# EAGLE schematic Proj_v27 (EAGLE 9.6.0)

## Sheet 1 of 7
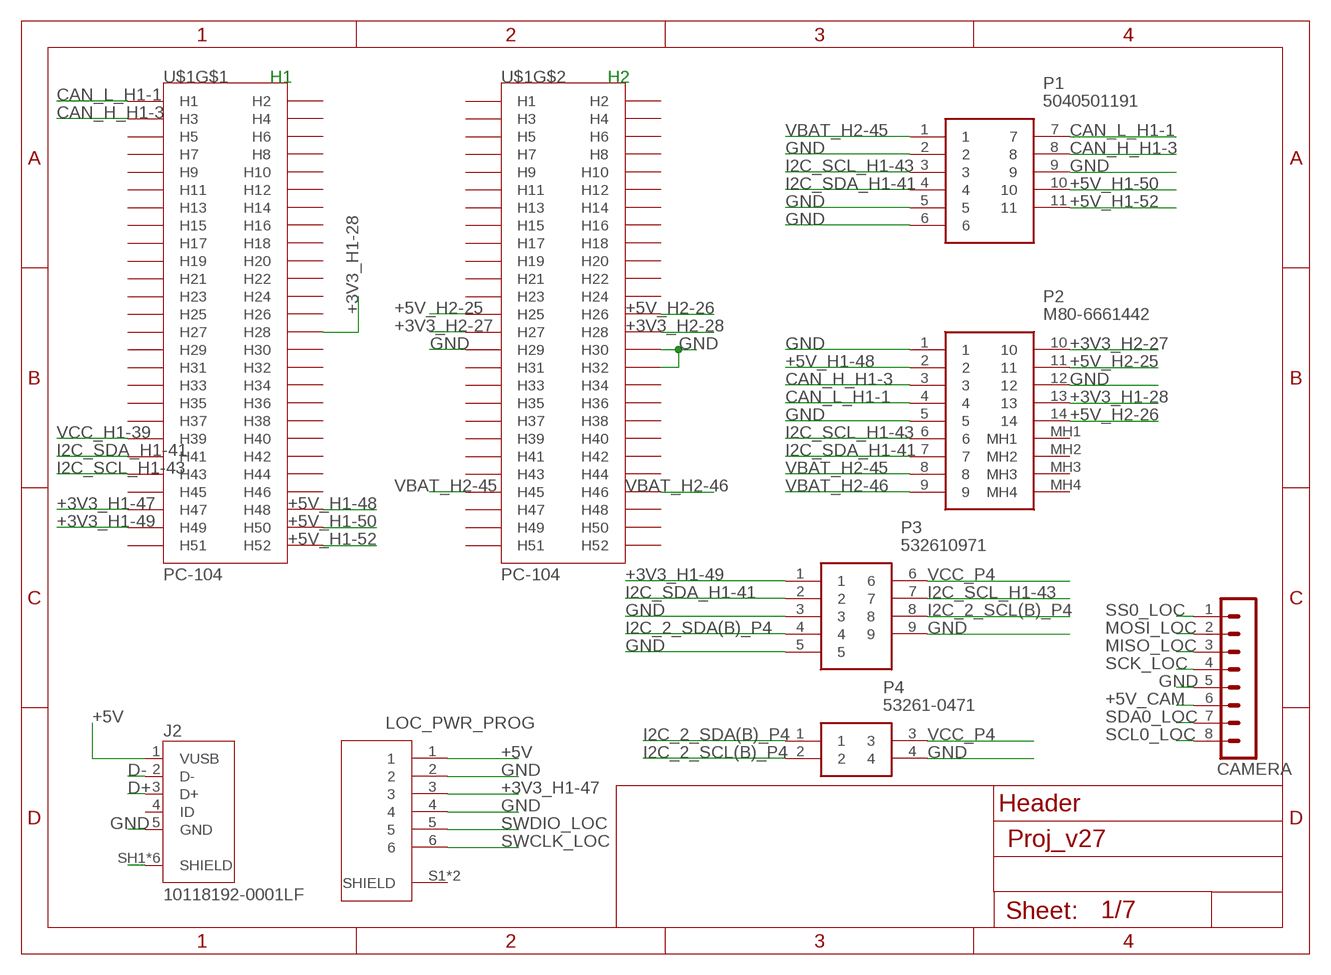
[diagram p0: schematic, sheet 1]

### Parts
CAMERA  MA08-1  [MA08-1]
J2  10118192-0001LF  [AMPHENOL_10118192-0001LF]
LOC_PWR_PROG  0532610671  [MOLEX_0532610671]
P1  5040501191  [5040501191]
P2  M80-6661442  [M806661442]
P3  532610971  [532610971]
P4  53261-0471  [53261-0471]
U$1  PC-104  [PC-104]

### Nets
+3V3_H1-28: P2.13 U$1.P$28(H28)
+3V3_H1-47: LOC_PWR_PROG.3 U$1.P$47(H47) ; also sheet 2,3,4,5
+3V3_H1-49: P3.1 U$1.P$49(H49)
+3V3_H2-27: P2.10 U$1.P$79(H27)
+3V3_H2-28: U$1.P$80(H28)
+5V: J2.1(VUSB) LOC_PWR_PROG.1 ; also sheet 2,5
+5V_CAM: CAMERA.6 ; also sheet 2
+5V_H1-48: P2.2 U$1.P$48(H48)
+5V_H1-50: P1.10 U$1.P$50(H50)
+5V_H1-52: P1.11 U$1.P$52(H52)
+5V_H2-25: P2.11 U$1.P$77(H25)
+5V_H2-26: P2.14 U$1.P$78(H26)
CAN_H_H1-3: P1.8 P2.3 U$1.P$3(H3)
CAN_L_H1-1: P1.7 P2.4 U$1.P$1(H1)
D+: J2.3(D+) ; also sheet 3
D-: J2.2(D-) ; also sheet 3
GND [GND]: CAMERA.5 J2.5(GND) J2.SH1(SHIELD) J2.SH2(SHIELD) J2.SH3(SHIELD) J2.SH4(SHIELD) J2.SH5(SHIELD) J2.SH6(SHIELD) LOC_PWR_PROG.2 LOC_PWR_PROG.4 P1.2 P1.5 P1.6 P1.9 P2.1 P2.5 P2.12 P3.3 P3.5 P3.9 P4.4 U$1.P$81(H29) U$1.P$82(H30) U$1.P$84(H32) ; also sheet 2,3,4,5,6,7
I2C_2_SCL(B)_P4: P3.8 P4.2
I2C_2_SDA(B)_P4: P3.4 P4.1
I2C_SCL_H1-43: P1.3 P2.6 P3.7 U$1.P$43(H43) ; also sheet 3
I2C_SDA_H1-41: P1.4 P2.7 P3.2 U$1.P$41(H41) ; also sheet 3
MISO_LOC: CAMERA.3 ; also sheet 3
MOSI_LOC: CAMERA.2 ; also sheet 3
SCK_LOC: CAMERA.4 ; also sheet 3
SCL0_LOC: CAMERA.8 ; also sheet 3
SDA0_LOC: CAMERA.7 ; also sheet 3
SS0_LOC: CAMERA.1 ; also sheet 3
SWCLK_LOC: LOC_PWR_PROG.6 ; also sheet 3
SWDIO_LOC: LOC_PWR_PROG.5 ; also sheet 3
VBAT_H2-45: P1.1 P2.8 U$1.P$97(H45)
VBAT_H2-46: P2.9 U$1.P$98(H46)
VCC_H1-39: U$1.P$39(H39)
VCC_P4: P3.6 P4.3
Unconnected: J2.4(ID) LOC_PWR_PROG.S1(SHIELD) LOC_PWR_PROG.S2(SHIELD) P2.MH1 P2.MH2 P2.MH3 P2.MH4 U$1.P$2(H2) U$1.P$4(H4) U$1.P$5(H5) U$1.P$6(H6) U$1.P$7(H7) U$1.P$8(H8) U$1.P$9(H9) U$1.P$10(H10) U$1.P$11(H11) U$1.P$12(H12) U$1.P$13(H13) U$1.P$14(H14) U$1.P$15(H15) U$1.P$16(H16) U$1.P$17(H17) U$1.P$18(H18) U$1.P$19(H19) U$1.P$20(H20) U$1.P$21(H21) U$1.P$22(H22) U$1.P$23(H23) U$1.P$24(H24) U$1.P$25(H25) U$1.P$26(H26) U$1.P$27(H27) U$1.P$29(H29) U$1.P$30(H30) U$1.P$31(H31) U$1.P$32(H32) U$1.P$33(H33) U$1.P$34(H34) U$1.P$35(H35) U$1.P$36(H36) U$1.P$37(H37) U$1.P$38(H38) U$1.P$40(H40) U$1.P$42(H42) U$1.P$44(H44) U$1.P$45(H45) U$1.P$46(H46) U$1.P$51(H51) U$1.P$53(H1) U$1.P$54(H2) U$1.P$55(H3) U$1.P$56(H4) U$1.P$57(H5) U$1.P$58(H6) U$1.P$59(H7) U$1.P$60(H8) U$1.P$61(H9) U$1.P$62(H10) U$1.P$63(H11) U$1.P$64(H12) U$1.P$65(H13) U$1.P$66(H14) U$1.P$67(H15) U$1.P$68(H16) U$1.P$69(H17) U$1.P$70(H18) U$1.P$71(H19) U$1.P$72(H20) U$1.P$73(H21) U$1.P$74(H22) U$1.P$75(H23) U$1.P$76(H24) U$1.P$83(H31) U$1.P$85(H33) U$1.P$86(H34) U$1.P$87(H35) U$1.P$88(H36) U$1.P$89(H37) U$1.P$90(H38) U$1.P$91(H39) U$1.P$92(H40) U$1.P$93(H41) U$1.P$94(H42) U$1.P$95(H43) U$1.P$96(H44) U$1.P$99(H47) U$1.P$100(H48) U$1.P$101(H49) U$1.P$102(H50) U$1.P$103(H51) U$1.P$104(H52)

### Notes on the sheet
- H1 | H2
- Header

## Sheet 2 of 7
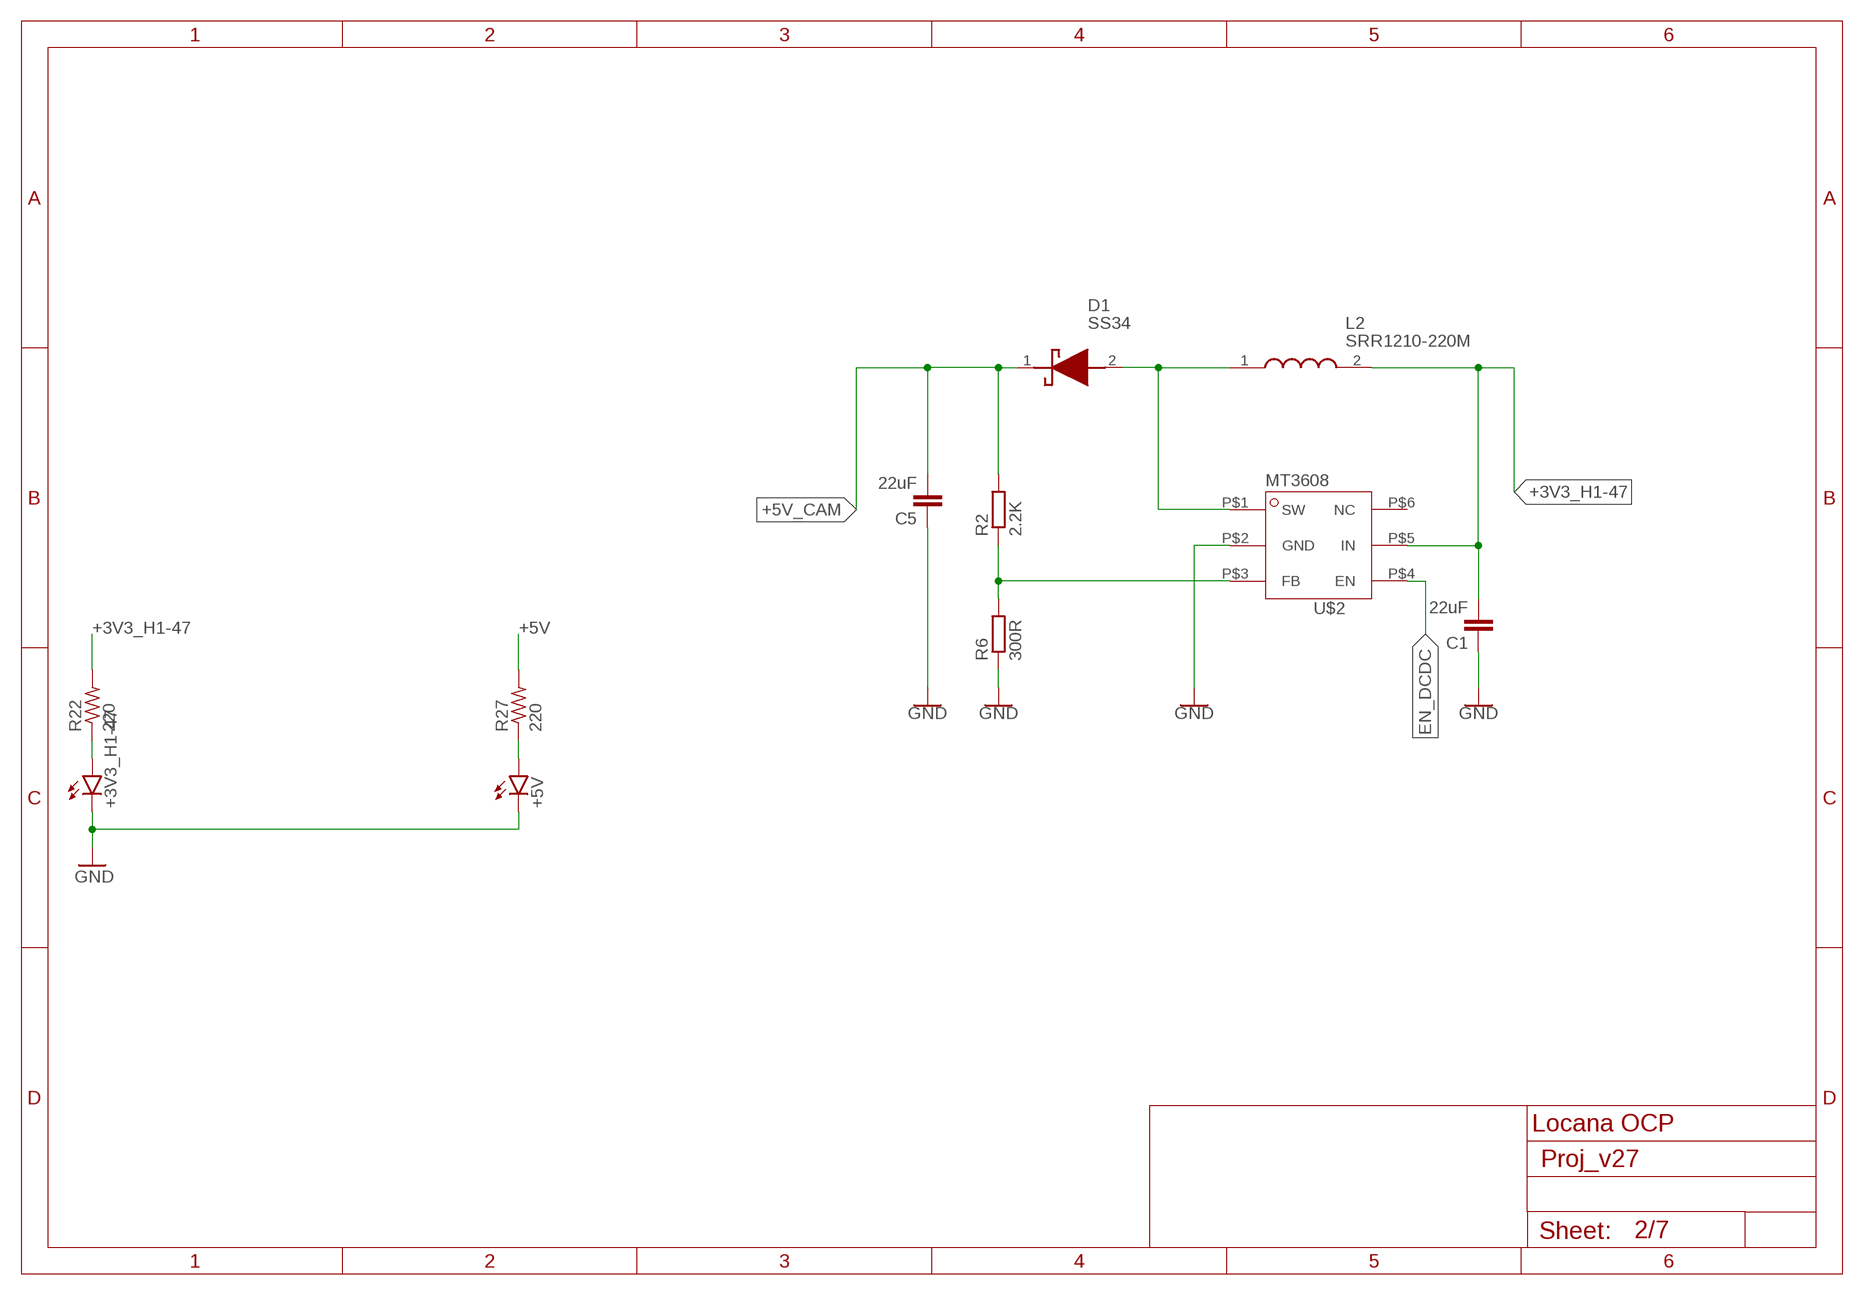
[diagram p1: schematic, sheet 2]

### Parts
+3V3_H1-47  LEDCHIP-LED0805  [CHIP-LED0805]
+5V  LEDCHIP-LED0805  [CHIP-LED0805]
C1  22uF  C-EUC0805  [C0805]
C5  22uF  C-EUC0805  [C0805]
D1  SS34  [DIOM7959X262N]
L2  SRR1210-220M  [INDPM120120X1000N]
R2  2.2K  R-EU_M0805  [M0805]
R6  300R  R-EU_M0805  [M0805]
R22  220  R-US_M0805  [M0805]
R27  220  R-US_M0805  [M0805]
U$2  MT3608SOT23-6  [SOT23-6]

### Nets
+3V3_H1-47: C1.2 L2.2 R22.2 U$2.P$5(IN) ; also sheet 1,3,4,5
+5V: R27.2 ; also sheet 1,5
+5V_CAM: C5.2 D1.1(K) R2.2 ; also sheet 1
EN_DCDC: U$2.P$4(EN) ; also sheet 3
GND [GND]: +3V3_H1-47.C +5V.C C1.1 C5.1 R6.1 U$2.P$2(GND) ; also sheet 1,3,4,5,6,7
N$7: D1.2(A) L2.1 U$2.P$1(SW)
N$13: R2.1 R6.2 U$2.P$3(FB)
N$14: +3V3_H1-47.A R22.1
N$23: +5V.A R27.1
Unconnected: U$2.P$6(NC)

### Notes on the sheet
- Locana OCP

## Sheet 3 of 7
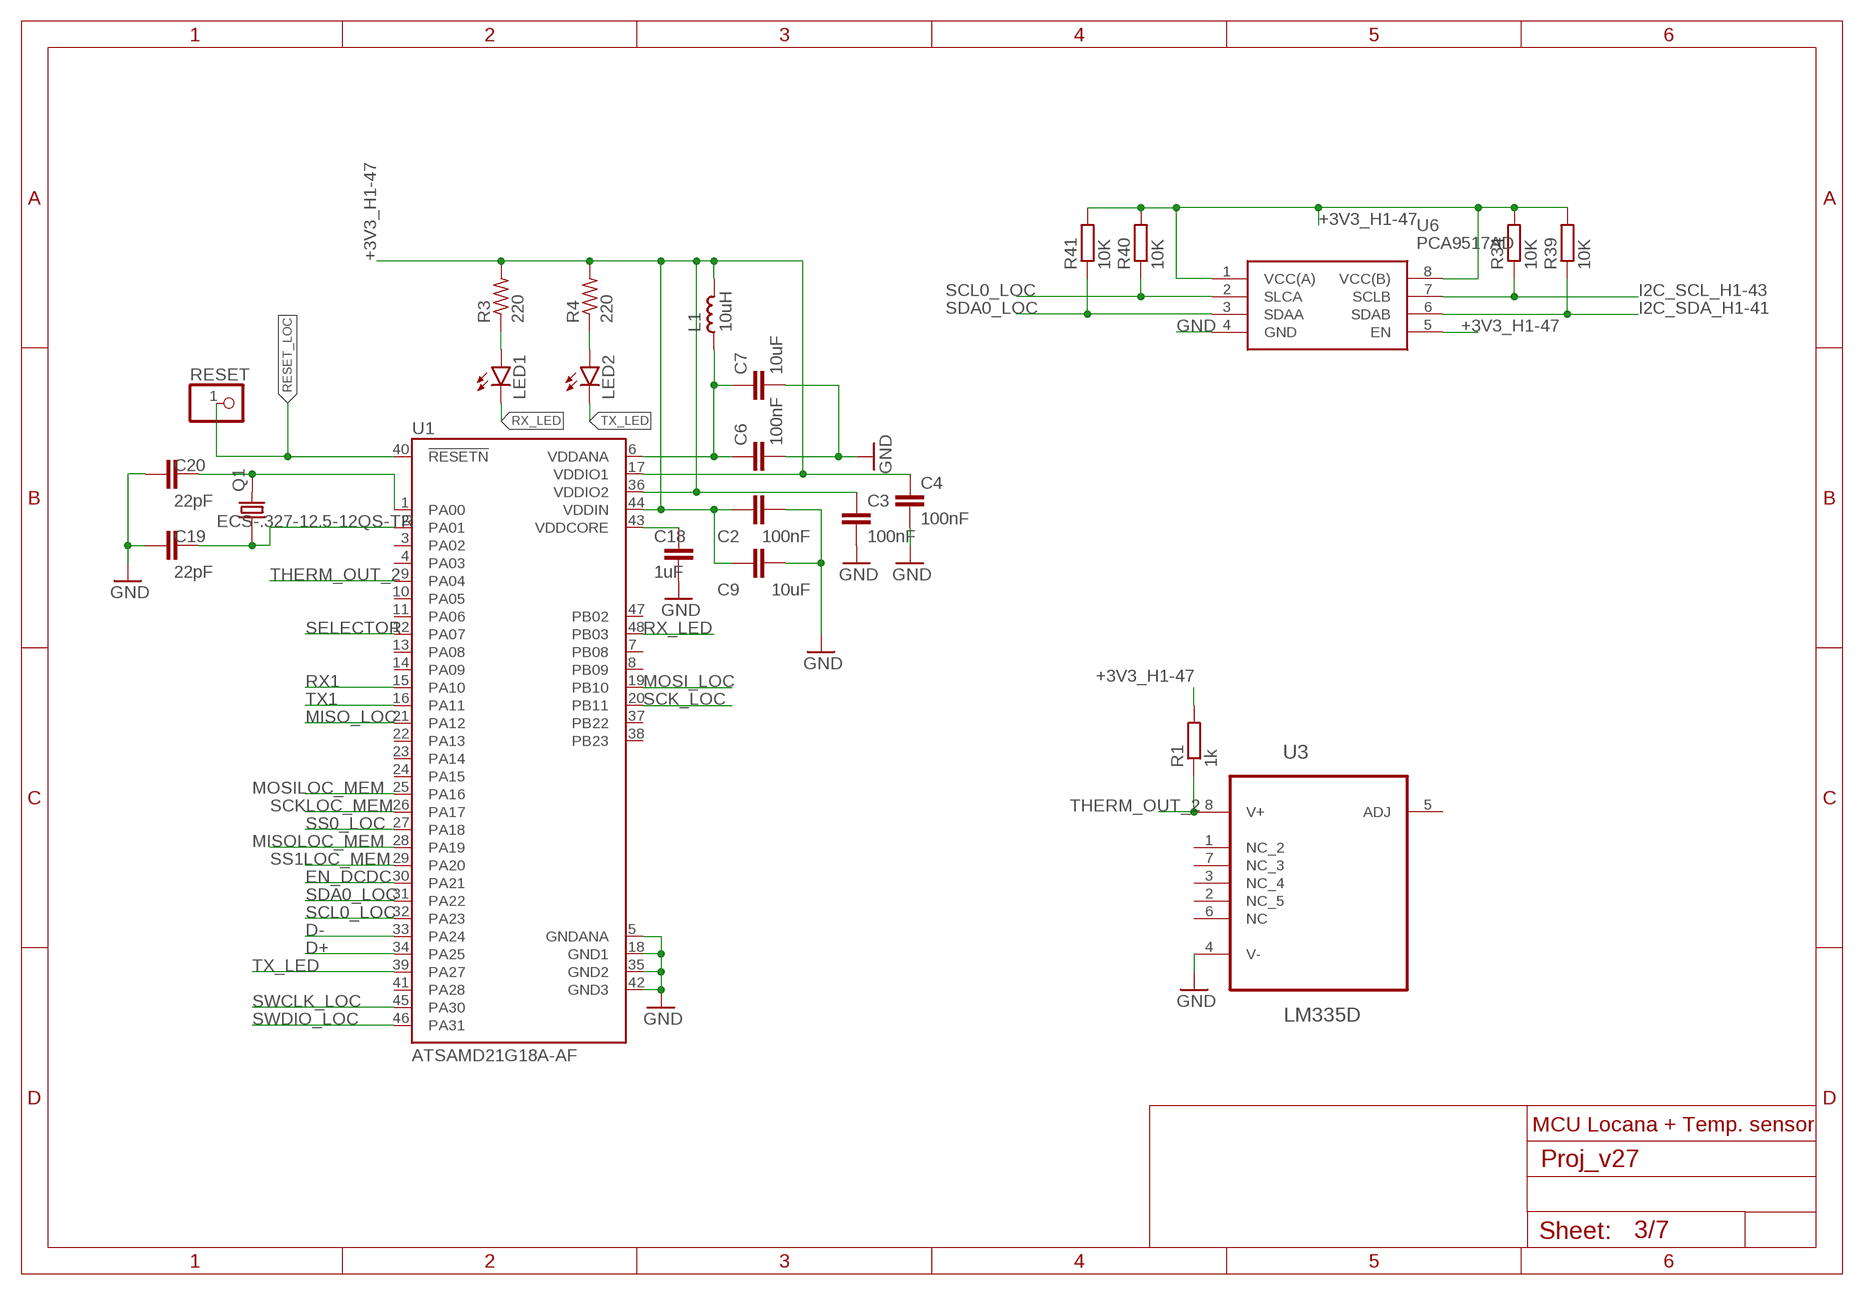
[diagram p2: schematic, sheet 3]

### Parts
C2  100nF  C-EUC0805K  [C0805K]
C3  100nF  C-EUC0805K  [C0805K]
C4  100nF  C-EUC0805K  [C0805K]
C6  100nF  C-EUC0805K  [C0805K]
C7  10uF  C-EUC0805K  [C0805K]
C9  10uF  C-EUC0805K  [C0805K]
C18  1uF  C-EUC0805K  [C0805K]
C19  22pF  C-EUC0805K  [C0805K]
C20  22pF  C-EUC0805K  [C0805K]
L1  10uH  L_0805  [L0805]
LED1  LEDCHIP-LED0805  [CHIP-LED0805]
LED2  LEDCHIP-LED0805  [CHIP-LED0805]
Q1  ECS-.327-12.5-12QS-TR  [XTAL_ECS-.327-12.5-12QS-TR]
R1  1k  R-EU_M0805  [M0805]
R3  220  R-US_M0805  [M0805]
R4  220  R-US_M0805  [M0805]
R34  10K  R-EU_M0805  [M0805]
R39  10K  R-EU_M0805  [M0805]
R40  10K  R-EU_M0805  [M0805]
R41  10K  R-EU_M0805  [M0805]
RESET  PINHD-1X1  [1X01]
U1  ATSAMD21G18A-AF  [QFP50P900X900X120-48N]
U3  LM335D  [SOIC127P600X175-8N]
U6  PCA9517AD  [SOIC127P600X175-8N]

### Nets
+3V3_H1-47: C2.1 C3.1 C4.1 C9.1 L1.1 R1.2 R3.2 R4.2 R34.2 R39.2 R40.2 R41.2 U1.17(VDDIO1) U1.36(VDDIO2) U1.44(VDDIN) U6.1(VCC(A)) U6.5(EN) U6.8(VCC(B)) ; also sheet 1,2,4,5
D+: U1.34(PA25) ; also sheet 1
D-: U1.33(PA24) ; also sheet 1
EN_DCDC: U1.30(PA21) ; also sheet 2
GND [GND]: C2.2 C3.2 C4.2 C6.2 C7.2 C9.2 C18.2 C19.1 C20.1 U1.5(GNDANA) U1.18(GND1) U1.35(GND2) U1.42(GND3) U3.4(V-) U6.4(GND) ; also sheet 1,2,4,5,6,7
I2C_SCL_H1-43: R34.1 U6.7(SCLB) ; also sheet 1
I2C_SDA_H1-41: R39.1 U6.6(SDAB) ; also sheet 1
MISO_LOC: U1.21(PA12) ; also sheet 1
MISOLOC_MEM: U1.28(PA19) ; also sheet 4
MOSI_LOC: U1.19(PB10) ; also sheet 1
MOSILOC_MEM: U1.25(PA16) ; also sheet 4
N$1: C20.2 Q1.2 U1.1(PA00)
N$6: C6.1 C7.1 L1.2 U1.6(VDDANA)
N$9: LED1.A R3.1
N$10: C18.1 U1.43(VDDCORE)
N$11: C19.2 Q1.1 U1.2(PA01)
N$12: LED2.A R4.1
RESET_LOC: RESET.1 U1.40(!RESETN)
RX1: U1.15(PA10) ; also sheet 5,7
RX_LED: LED1.C U1.48(PB03)
SCK_LOC: U1.20(PB11) ; also sheet 1
SCKLOC_MEM: U1.26(PA17) ; also sheet 4
SCL0_LOC: R40.1 U1.32(PA23) U6.2(SLCA) ; also sheet 1
SDA0_LOC: R41.1 U1.31(PA22) U6.3(SDAA) ; also sheet 1
SELECTOR: U1.12(PA07) ; also sheet 4
SS0_LOC: U1.27(PA18) ; also sheet 1
SS1LOC_MEM: U1.29(PA20) ; also sheet 4
SWCLK_LOC: U1.45(PA30) ; also sheet 1
SWDIO_LOC: U1.46(PA31) ; also sheet 1
THERM_OUT_2: R1.1 U1.9(PA04) U3.8(V+)
TX1: U1.16(PA11) ; also sheet 5,7
TX_LED: LED2.C U1.39(PA27)
Unconnected: U1.3(PA02) U1.4(PA03) U1.7(PB08) U1.8(PB09) U1.10(PA05) U1.11(PA06) U1.13(PA08) U1.14(PA09) U1.22(PA13) U1.23(PA14) U1.24(PA15) U1.37(PB22) U1.38(PB23) U1.41(PA28) U1.47(PB02) U3.1(NC_2) U3.2(NC_5) U3.3(NC_4) U3.5(ADJ) U3.6(NC) U3.7(NC_3)

### Notes on the sheet
- MCU Locana + Temp. sensor

## Sheet 4 of 7
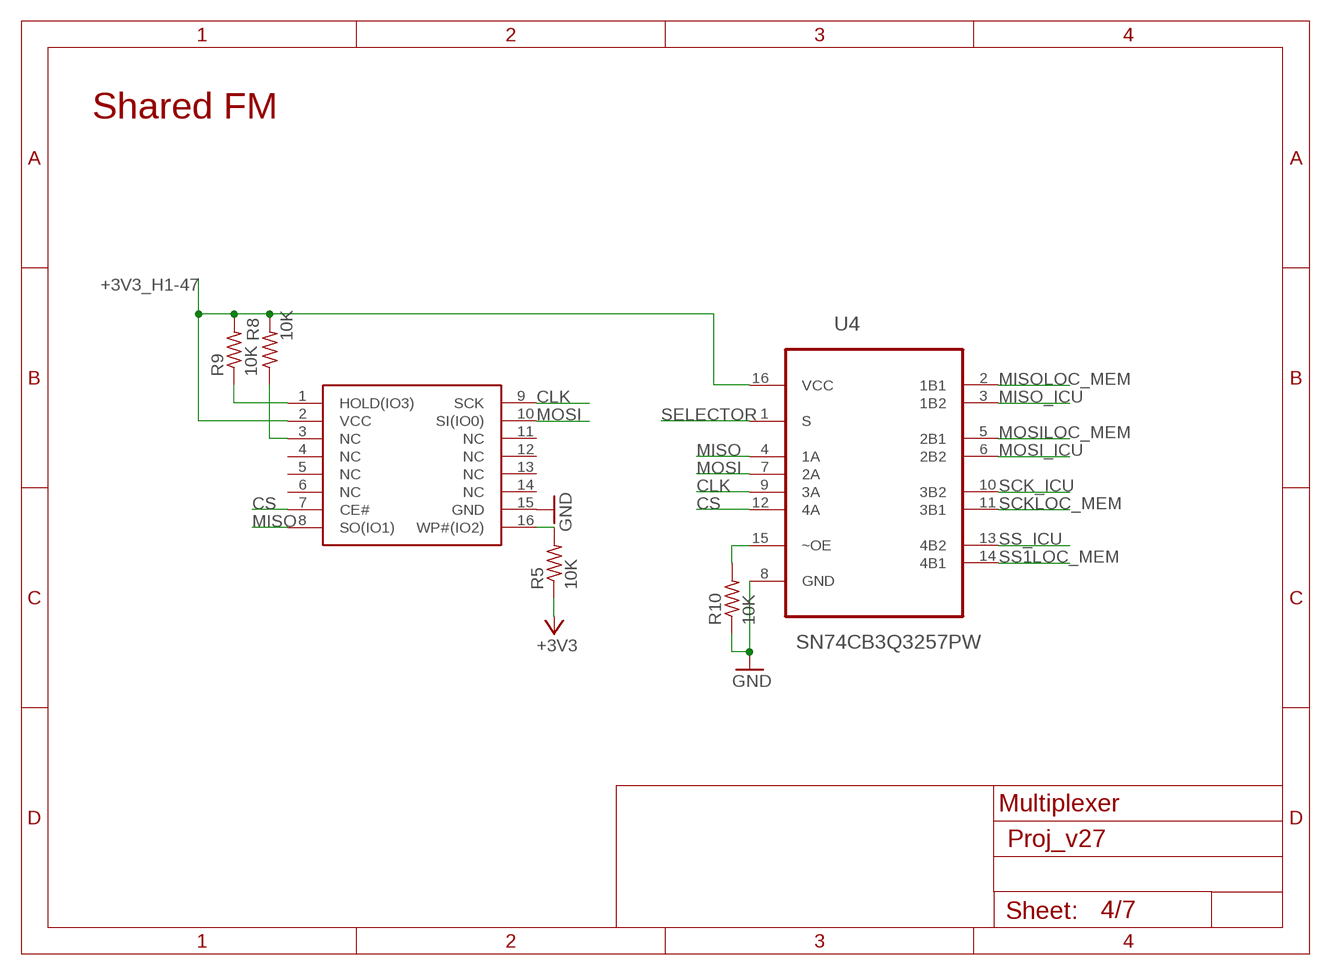
[diagram p3: schematic, sheet 4]

### Parts
LOC_MEM  SOIC127P600X175-16NSOIC-16YAS  [SOIC127P1032X265-17T480X861N]
R5  10K  R-US_M0805  [M0805]
R8  10K  R-US_M0805  [M0805]
R9  10K  R-US_M0805  [M0805]
R10  10K  R-US_M0805  [M0805]
U4  SN74CB3Q3257PW  [SOP65P640X120-16N]

### Nets
+3V3_H1-47: LOC_MEM.2(VCC) R5.1 R8.2 R9.2 U4.16(VCC) ; supply symbol labelled +3V3 ; also sheet 1,2,3,5
CLK: LOC_MEM.9(SCK) U4.9(3A)
CS: LOC_MEM.7(CE#) U4.12(4A)
GND [GND]: LOC_MEM.15(GND) R10.1 U4.8(GND) ; also sheet 1,2,3,5,6,7
MISO: LOC_MEM.8(SO(IO1)) U4.4(1A)
MISO_ICU: U4.3(1B2) ; also sheet 7
MISOLOC_MEM: U4.2(1B1) ; also sheet 3
MOSI: LOC_MEM.10(SI(IO0)) U4.7(2A)
MOSI_ICU: U4.6(2B2) ; also sheet 7
MOSILOC_MEM: U4.5(2B1) ; also sheet 3
N$2: LOC_MEM.16(WP#(IO2)) R5.2
N$3: LOC_MEM.1(HOLD(IO3)) R9.1
N$4: LOC_MEM.3(NC) R8.1
N$31: R10.2 U4.15(~OE)
SCK_ICU: U4.10(3B2) ; also sheet 7
SCKLOC_MEM: U4.11(3B1) ; also sheet 3
SELECTOR: U4.1(S) ; also sheet 3
SS1LOC_MEM: U4.14(4B1) ; also sheet 3
SS_ICU: U4.13(4B2) ; also sheet 6,7
Unconnected: LOC_MEM.4(NC) LOC_MEM.5(NC) LOC_MEM.6(NC) LOC_MEM.11(NC) LOC_MEM.12(NC) LOC_MEM.13(NC) LOC_MEM.14(NC)

### Notes on the sheet
- Shared FM
- Multiplexer

## Sheet 5 of 7
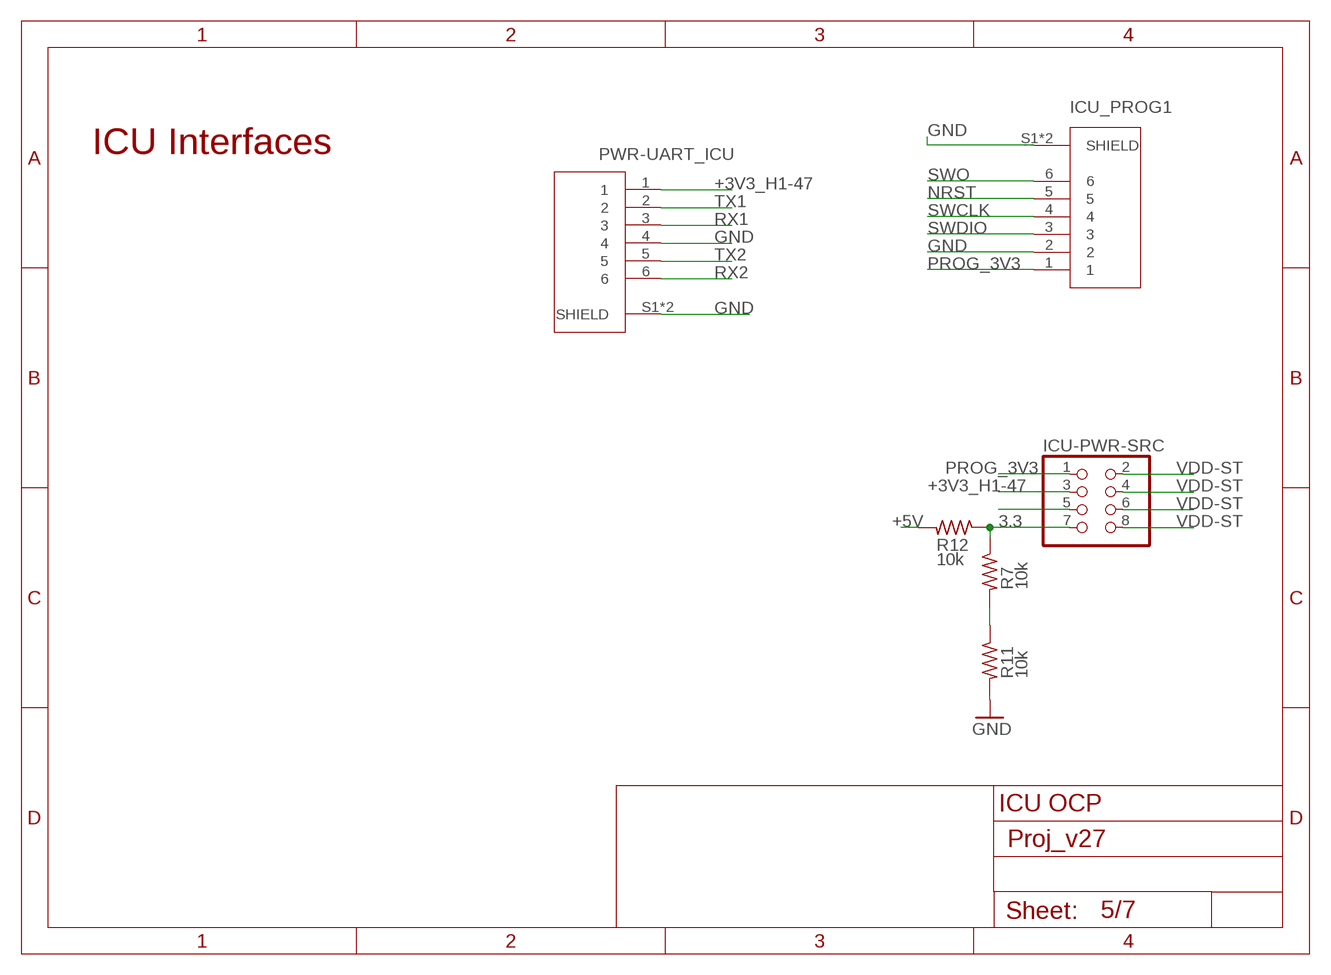
[diagram p4: schematic, sheet 5]

### Parts
ICU-PWR-SRC  PINHD-2X4  [2X04]
ICU_PROG1  0532610671  [MOLEX_0532610671]
PWR-UART_ICU  0532610671  [MOLEX_0532610671]
R7  10k  R-US_R0805  [R0805]
R11  10k  R-US_R0805  [R0805]
R12  10k  R-US_R0805  [R0805]

### Nets
3.3: ICU-PWR-SRC.7 R7.1 R12.1
+3V3_H1-47: ICU-PWR-SRC.3 PWR-UART_ICU.1 ; also sheet 1,2,3,4
+5V: R12.2 ; also sheet 1,2
GND [GND]: ICU_PROG1.2 ICU_PROG1.S1(SHIELD) ICU_PROG1.S2(SHIELD) PWR-UART_ICU.4 PWR-UART_ICU.S1(SHIELD) PWR-UART_ICU.S2(SHIELD) R11.2 ; also sheet 1,2,3,4,6,7
N$15: R7.2 R11.1
N$28: ICU-PWR-SRC.5
NRST: ICU_PROG1.5 ; also sheet 7
PROG_3V3: ICU-PWR-SRC.1 ICU_PROG1.1
RX1: PWR-UART_ICU.3 ; also sheet 3,7
RX2: PWR-UART_ICU.6 ; also sheet 7
SWCLK: ICU_PROG1.4 ; also sheet 7
SWDIO: ICU_PROG1.3 ; also sheet 7
SWO: ICU_PROG1.6 ; also sheet 7
TX1: PWR-UART_ICU.2 ; also sheet 3,7
TX2: PWR-UART_ICU.5 ; also sheet 7
VDD-ST: ICU-PWR-SRC.2 ICU-PWR-SRC.4 ICU-PWR-SRC.6 ICU-PWR-SRC.8 ; also sheet 6,7

### Notes on the sheet
- ICU Interfaces
- ICU OCP

## Sheet 6 of 7
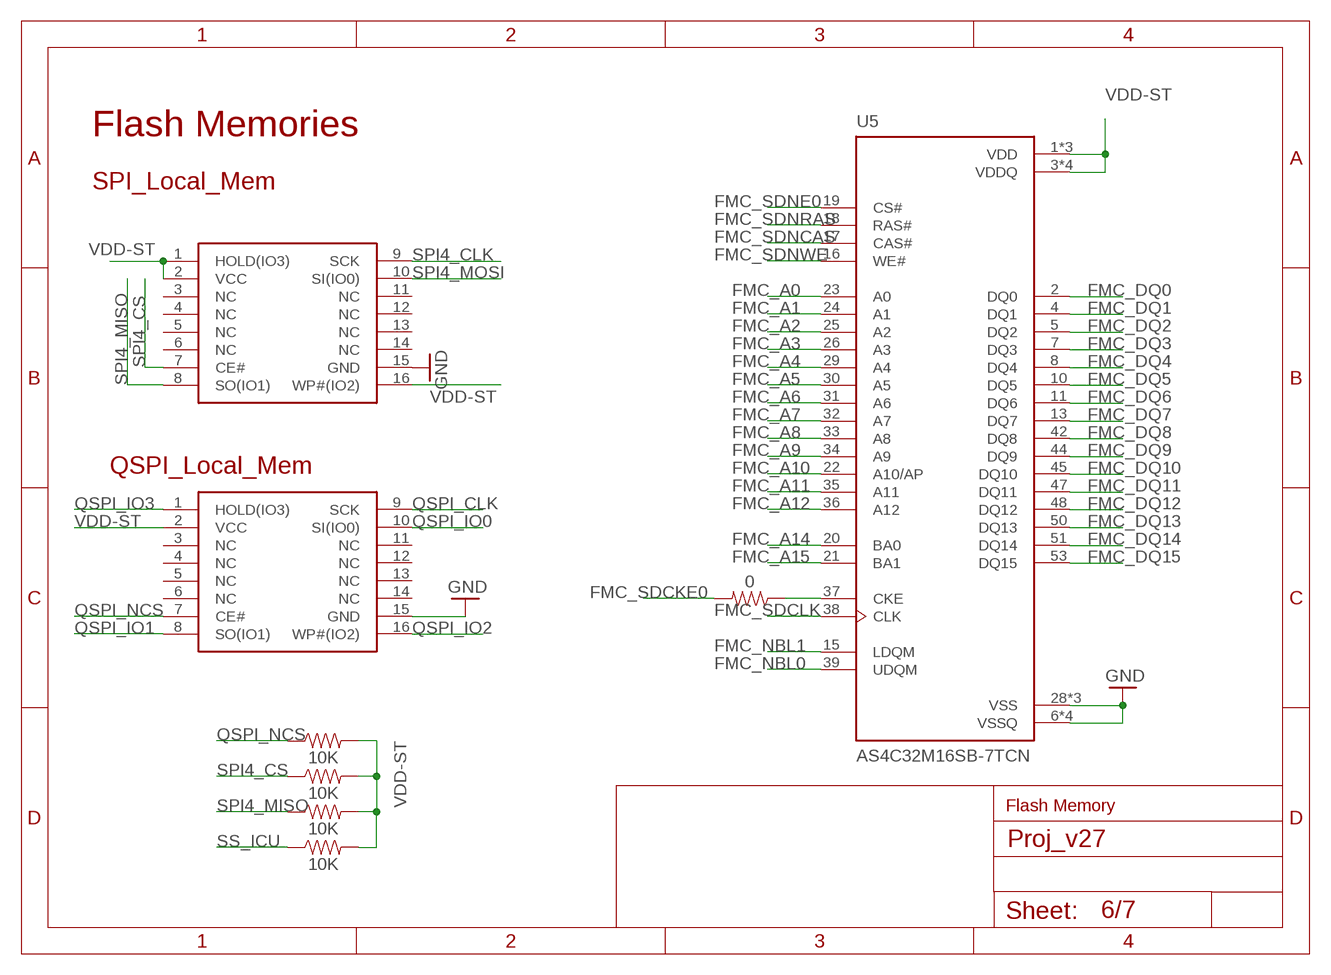
[diagram p5: schematic, sheet 6]

### Parts
LOCAL_MEM  SOIC127P600X175-16NSOIC-16YAS  [SOIC127P1032X265-17T480X861N]
QSPI_MEM  SOIC127P600X175-16NSOIC-16YAS  [SOIC127P1032X265-17T480X861N]
R25  0  R0805(2012)  [R0805]
R76  10K  R0805(2012)  [R0805]
R77  10K  R0805(2012)  [R0805]
R78  10K  R0805(2012)  [R0805]
R79  10K  R0805(2012)  [R0805]
U5  AS4C32M16SB-7TCN  [SOP80P1176X120-54N]

### Nets
FMC_A0: U5.23(A0) ; also sheet 7
FMC_A1: U5.24(A1) ; also sheet 7
FMC_A2: U5.25(A2) ; also sheet 7
FMC_A3: U5.26(A3) ; also sheet 7
FMC_A4: U5.29(A4) ; also sheet 7
FMC_A5: U5.30(A5) ; also sheet 7
FMC_A6: U5.31(A6) ; also sheet 7
FMC_A7: U5.32(A7) ; also sheet 7
FMC_A8: U5.33(A8) ; also sheet 7
FMC_A9: U5.34(A9) ; also sheet 7
FMC_A10: U5.22(A10/AP) ; also sheet 7
FMC_A11: U5.35(A11) ; also sheet 7
FMC_A12: U5.36(A12) ; also sheet 7
FMC_A14: U5.20(BA0) ; also sheet 7
FMC_A15: U5.21(BA1) ; also sheet 7
FMC_DQ0: U5.2(DQ0) ; also sheet 7
FMC_DQ1: U5.4(DQ1) ; also sheet 7
FMC_DQ2: U5.5(DQ2) ; also sheet 7
FMC_DQ3: U5.7(DQ3) ; also sheet 7
FMC_DQ4: U5.8(DQ4) ; also sheet 7
FMC_DQ5: U5.10(DQ5) ; also sheet 7
FMC_DQ6: U5.11(DQ6) ; also sheet 7
FMC_DQ7: U5.13(DQ7) ; also sheet 7
FMC_DQ8: U5.42(DQ8) ; also sheet 7
FMC_DQ9: U5.44(DQ9) ; also sheet 7
FMC_DQ10: U5.45(DQ10) ; also sheet 7
FMC_DQ11: U5.47(DQ11) ; also sheet 7
FMC_DQ12: U5.48(DQ12) ; also sheet 7
FMC_DQ13: U5.50(DQ13) ; also sheet 7
FMC_DQ14: U5.51(DQ14) ; also sheet 7
FMC_DQ15: U5.53(DQ15) ; also sheet 7
FMC_NBL0: U5.39(UDQM) ; also sheet 7
FMC_NBL1: U5.15(LDQM) ; also sheet 7
FMC_SDCKE0: R25.1 R25.2 U5.37(CKE) ; also sheet 7
FMC_SDCLK: U5.38(CLK) ; also sheet 7
FMC_SDNCAS: U5.17(CAS#) ; also sheet 7
FMC_SDNE0: U5.19(CS#) ; also sheet 7
FMC_SDNRAS: U5.18(RAS#) ; also sheet 7
FMC_SDNWE: U5.16(WE#) ; also sheet 7
GND [GND]: LOCAL_MEM.15(GND) QSPI_MEM.15(GND) U5.6(VSSQ) U5.12(VSSQ) U5.28(VSS) U5.41(VSS) U5.46(VSSQ) U5.52(VSSQ) U5.54(VSS) ; also sheet 1,2,3,4,5,7
QSPI_CLK: QSPI_MEM.9(SCK) ; also sheet 7
QSPI_IO0: QSPI_MEM.10(SI(IO0)) ; also sheet 7
QSPI_IO1: QSPI_MEM.8(SO(IO1)) ; also sheet 7
QSPI_IO2: QSPI_MEM.16(WP#(IO2)) ; also sheet 7
QSPI_IO3: QSPI_MEM.1(HOLD(IO3)) ; also sheet 7
QSPI_NCS: QSPI_MEM.7(CE#) R79.1 ; also sheet 7
SPI4_CLK: LOCAL_MEM.9(SCK) ; also sheet 7
SPI4_CS: LOCAL_MEM.7(CE#) R78.1 ; also sheet 7
SPI4_MISO: LOCAL_MEM.8(SO(IO1)) R77.1 ; also sheet 7
SPI4_MOSI: LOCAL_MEM.10(SI(IO0)) ; also sheet 7
SS_ICU: R76.1 ; also sheet 4,7
VDD-ST: LOCAL_MEM.1(HOLD(IO3)) LOCAL_MEM.2(VCC) LOCAL_MEM.16(WP#(IO2)) QSPI_MEM.2(VCC) R76.2 R77.2 R78.2 R79.2 U5.1(VDD) U5.3(VDDQ) U5.9(VDDQ) U5.14(VDD) U5.27(VDD) U5.43(VDDQ) U5.49(VDDQ) ; also sheet 5,7
Unconnected: LOCAL_MEM.3(NC) LOCAL_MEM.4(NC) LOCAL_MEM.5(NC) LOCAL_MEM.6(NC) LOCAL_MEM.11(NC) LOCAL_MEM.12(NC) LOCAL_MEM.13(NC) LOCAL_MEM.14(NC) QSPI_MEM.3(NC) QSPI_MEM.4(NC) QSPI_MEM.5(NC) QSPI_MEM.6(NC) QSPI_MEM.11(NC) QSPI_MEM.12(NC) QSPI_MEM.13(NC) QSPI_MEM.14(NC)

### Notes on the sheet
- Flash Memories
- SPI_Local_Mem
- QSPI_Local_Mem
- Flash Memory

## Sheet 7 of 7
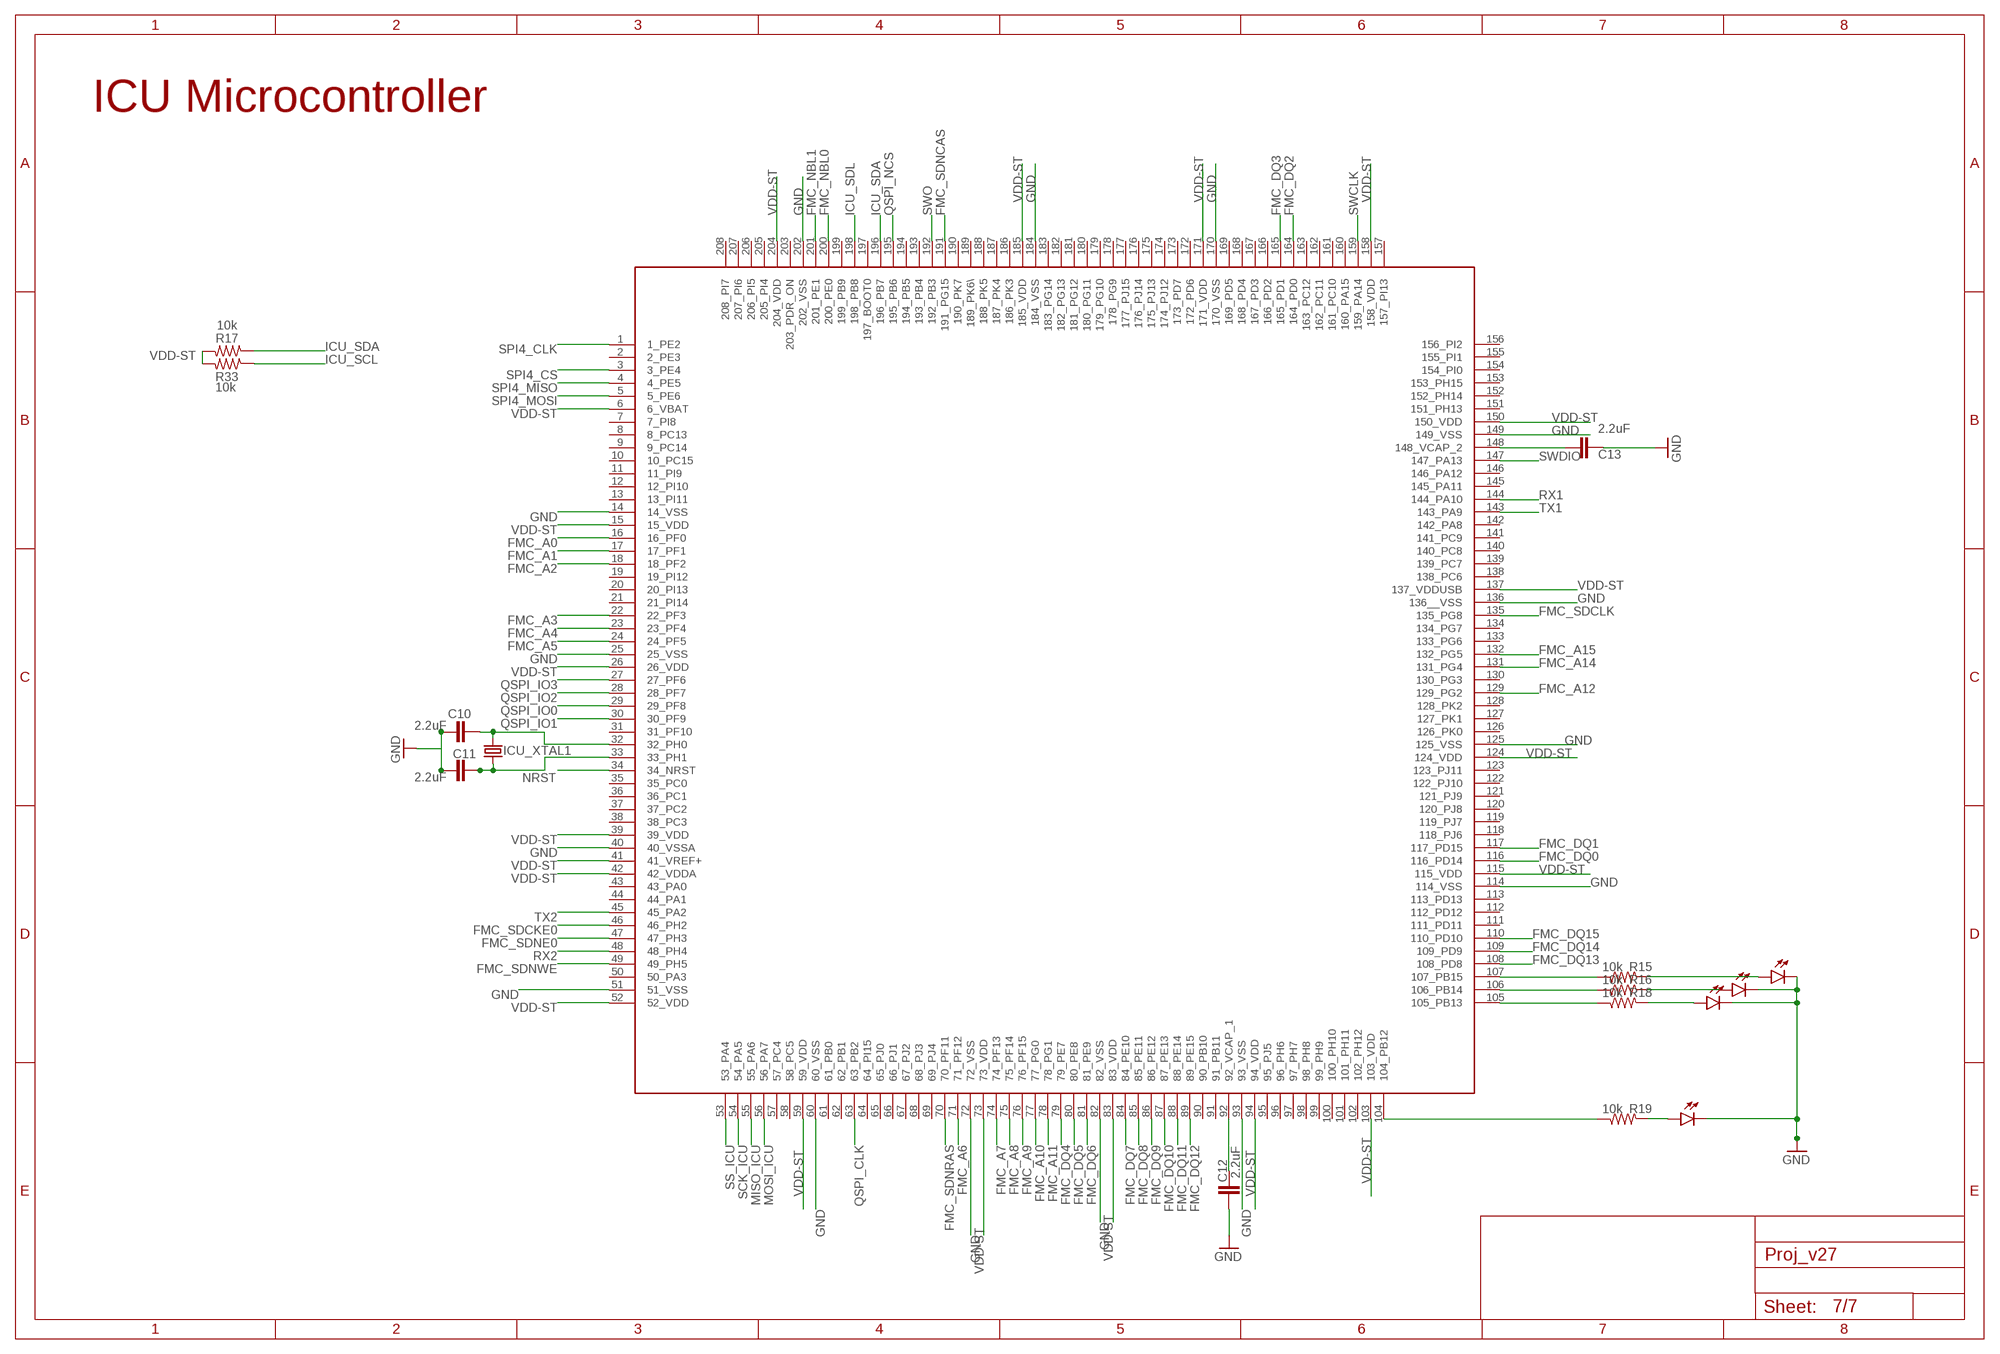
[diagram p6: schematic, sheet 7]

### Parts
C10  2.2uF  C-EUC0805  [C0805]
C11  2.2uF  C-EUC0805  [C0805]
C12  2.2uF  C-EUC0805  [C0805]
C13  2.2uF  C-EUC0805  [C0805]
ICU_XTAL1  CRYSTALHC49UP  [HC49UP]
L07  LEDCHIPLED_0805  [CHIPLED_0805]
L08  LEDCHIPLED_0805  [CHIPLED_0805]
L09  LEDCHIPLED_0805  [CHIPLED_0805]
L10  LEDCHIPLED_0805  [CHIPLED_0805]
R15  10k  R-US_R0805  [R0805]
R16  10k  R-US_R0805  [R0805]
R17  10k  R-US_R0805  [R0805]
R18  10k  R-US_R0805  [R0805]
R19  10k  R-US_R0805  [R0805]
R33  10k  R-US_R0805  [R0805]
STM32F7646BGT6  STM32F746BGT6  [QFP50P3000X3000X160-208N]

### Nets
FMC_A0: STM32F7646BGT6.16(16_PF0) ; also sheet 6
FMC_A1: STM32F7646BGT6.17(17_PF1) ; also sheet 6
FMC_A2: STM32F7646BGT6.18(18_PF2) ; also sheet 6
FMC_A3: STM32F7646BGT6.22(22_PF3) ; also sheet 6
FMC_A4: STM32F7646BGT6.23(23_PF4) ; also sheet 6
FMC_A5: STM32F7646BGT6.24(24_PF5) ; also sheet 6
FMC_A6: STM32F7646BGT6.71(71_PF12) ; also sheet 6
FMC_A7: STM32F7646BGT6.74(74_PF13) ; also sheet 6
FMC_A8: STM32F7646BGT6.75(75_PF14) ; also sheet 6
FMC_A9: STM32F7646BGT6.76(76_PF15) ; also sheet 6
FMC_A10: STM32F7646BGT6.77(77_PG0) ; also sheet 6
FMC_A11: STM32F7646BGT6.78(78_PG1) ; also sheet 6
FMC_A12: STM32F7646BGT6.129(129_PG2) ; also sheet 6
FMC_A14: STM32F7646BGT6.131(131_PG4) ; also sheet 6
FMC_A15: STM32F7646BGT6.132(132_PG5) ; also sheet 6
FMC_DQ0: STM32F7646BGT6.116(116_PD14) ; also sheet 6
FMC_DQ1: STM32F7646BGT6.117(117_PD15) ; also sheet 6
FMC_DQ2: STM32F7646BGT6.164(164_PD0) ; also sheet 6
FMC_DQ3: STM32F7646BGT6.165(165_PD1) ; also sheet 6
FMC_DQ4: STM32F7646BGT6.79(79_PE7) ; also sheet 6
FMC_DQ5: STM32F7646BGT6.80(80_PE8) ; also sheet 6
FMC_DQ6: STM32F7646BGT6.81(81_PE9) ; also sheet 6
FMC_DQ7: STM32F7646BGT6.84(84_PE10) ; also sheet 6
FMC_DQ8: STM32F7646BGT6.85(85_PE11) ; also sheet 6
FMC_DQ9: STM32F7646BGT6.86(86_PE12) ; also sheet 6
FMC_DQ10: STM32F7646BGT6.87(87_PE13) ; also sheet 6
FMC_DQ11: STM32F7646BGT6.88(88_PE14) ; also sheet 6
FMC_DQ12: STM32F7646BGT6.89(89_PE15) ; also sheet 6
FMC_DQ13: STM32F7646BGT6.108(108_PD8) ; also sheet 6
FMC_DQ14: STM32F7646BGT6.109(109_PD9) ; also sheet 6
FMC_DQ15: STM32F7646BGT6.110(110_PD10) ; also sheet 6
FMC_NBL0: STM32F7646BGT6.200(200_PE0) ; also sheet 6
FMC_NBL1: STM32F7646BGT6.201(201_PE1) ; also sheet 6
FMC_SDCKE0: STM32F7646BGT6.46(46_PH2) ; also sheet 6
FMC_SDCLK: STM32F7646BGT6.135(135_PG8) ; also sheet 6
FMC_SDNCAS: STM32F7646BGT6.191(191_PG15) ; also sheet 6
FMC_SDNE0: STM32F7646BGT6.47(47_PH3) ; also sheet 6
FMC_SDNRAS: STM32F7646BGT6.70(70_PF11) ; also sheet 6
FMC_SDNWE: STM32F7646BGT6.49(49_PH5) ; also sheet 6
GND [GND]: C10.1 C11.1 C12.1 C13.1 L07.C L08.C L09.C L10.C STM32F7646BGT6.14(14_VSS) STM32F7646BGT6.25(25_VSS) STM32F7646BGT6.40(40_VSSA) STM32F7646BGT6.51(51_VSS) STM32F7646BGT6.60(60_VSS) STM32F7646BGT6.72(72_VSS) STM32F7646BGT6.82(82_VSS) STM32F7646BGT6.93(93_VSS) STM32F7646BGT6.114(114_VSS) STM32F7646BGT6.125(125_VSS) STM32F7646BGT6.136(136__VSS) STM32F7646BGT6.149(149_VSS) STM32F7646BGT6.170(170_VSS) STM32F7646BGT6.184(184_VSS) STM32F7646BGT6.202(202_VSS) ; also sheet 1,2,3,4,5,6
ICU_SCL: R33.1
ICU_SDA: R17.1 STM32F7646BGT6.196(196_PB7)
ICU_SDL: STM32F7646BGT6.198(198_PB8)
L06: L09.A R18.2
L07: L10.A R19.2
L08: L07.A R15.2
L09: L08.A R16.2
MISO_ICU: STM32F7646BGT6.55(55_PA6) ; also sheet 4
MOSI_ICU: STM32F7646BGT6.56(56_PA7) ; also sheet 4
N$5: R19.1 STM32F7646BGT6.104(104_PB12)
N$8: R15.1 STM32F7646BGT6.107(107_PB15)
N$17: R16.1 STM32F7646BGT6.106(106_PB14)
N$18: R18.1 STM32F7646BGT6.105(105_PB13)
N$19: C10.2 ICU_XTAL1.2 STM32F7646BGT6.32(32_PH0)
N$22: C12.2 STM32F7646BGT6.92(92_VCAP_1)
N$24: C13.2 STM32F7646BGT6.148(148_VCAP_2)
NRST: STM32F7646BGT6.34(34_NRST) ; also sheet 5
QSPI_CLK: STM32F7646BGT6.63(63_PB2) ; also sheet 6
QSPI_IO0: STM32F7646BGT6.29(29_PF8) ; also sheet 6
QSPI_IO1: STM32F7646BGT6.30(30_PF9) ; also sheet 6
QSPI_IO2: STM32F7646BGT6.28(28_PF7) ; also sheet 6
QSPI_IO3: STM32F7646BGT6.27(27_PF6) ; also sheet 6
QSPI_NCS: STM32F7646BGT6.195(195_PB6) ; also sheet 6
RX1: STM32F7646BGT6.144(144_PA10) ; also sheet 3,5
RX2: STM32F7646BGT6.48(48_PH4) ; also sheet 5
SCK_ICU: STM32F7646BGT6.54(54_PA5) ; also sheet 4
SPI4_CLK: STM32F7646BGT6.1(1_PE2) ; also sheet 6
SPI4_CS: STM32F7646BGT6.3(3_PE4) ; also sheet 6
SPI4_MISO: STM32F7646BGT6.4(4_PE5) ; also sheet 6
SPI4_MOSI: STM32F7646BGT6.5(5_PE6) ; also sheet 6
SS_ICU: STM32F7646BGT6.53(53_PA4) ; also sheet 4,6
SWCLK: STM32F7646BGT6.159(159_PA14) ; also sheet 5
SWDIO: STM32F7646BGT6.147(147_PA13) ; also sheet 5
SWO: STM32F7646BGT6.192(192_PB3) ; also sheet 5
TX1: STM32F7646BGT6.143(143_PA9) ; also sheet 3,5
TX2: STM32F7646BGT6.45(45_PA2) ; also sheet 5
VDD-ST: R17.2 R33.2 STM32F7646BGT6.6(6_VBAT) STM32F7646BGT6.15(15_VDD) STM32F7646BGT6.26(26_VDD) STM32F7646BGT6.39(39_VDD) STM32F7646BGT6.41(41_VREF+) STM32F7646BGT6.42(42_VDDA) STM32F7646BGT6.52(52_VDD) STM32F7646BGT6.59(59_VDD) STM32F7646BGT6.73(73_VDD) STM32F7646BGT6.83(83_VDD) STM32F7646BGT6.94(94_VDD) STM32F7646BGT6.103(103_VDD) STM32F7646BGT6.115(115_VDD) STM32F7646BGT6.124(124_VDD) STM32F7646BGT6.137(137_VDDUSB) STM32F7646BGT6.150(150_VDD) STM32F7646BGT6.158(158_VDD) STM32F7646BGT6.171(171_VDD) STM32F7646BGT6.185(185_VDD) STM32F7646BGT6.204(204_VDD) ; also sheet 5,6
XTAL4: C11.2 ICU_XTAL1.1 STM32F7646BGT6.33(33_PH1)
Unconnected: STM32F7646BGT6.2(2_PE3) STM32F7646BGT6.7(7_PI8) STM32F7646BGT6.8(8_PC13) STM32F7646BGT6.9(9_PC14) STM32F7646BGT6.10(10_PC15) STM32F7646BGT6.11(11_PI9) STM32F7646BGT6.12(12_PI10) STM32F7646BGT6.13(13_PI11) STM32F7646BGT6.19(19_PI12) STM32F7646BGT6.20(20_PI13) STM32F7646BGT6.21(21_PI14) STM32F7646BGT6.31(31_PF10) STM32F7646BGT6.35(35_PC0) STM32F7646BGT6.36(36_PC1) STM32F7646BGT6.37(37_PC2) STM32F7646BGT6.38(38_PC3) STM32F7646BGT6.43(43_PA0) STM32F7646BGT6.44(44_PA1) STM32F7646BGT6.50(50_PA3) STM32F7646BGT6.57(57_PC4) STM32F7646BGT6.58(58_PC5) STM32F7646BGT6.61(61_PB0) STM32F7646BGT6.62(62_PB1) STM32F7646BGT6.64(64_PI15) STM32F7646BGT6.65(65_PJ0) STM32F7646BGT6.66(66_PJ1) STM32F7646BGT6.67(67_PJ2) STM32F7646BGT6.68(68_PJ3) STM32F7646BGT6.69(69_PJ4) STM32F7646BGT6.90(90_PB10) STM32F7646BGT6.91(91_PB11) STM32F7646BGT6.95(95_PJ5) STM32F7646BGT6.96(96_PH6) STM32F7646BGT6.97(97_PH7) STM32F7646BGT6.98(98_PH8) STM32F7646BGT6.99(99_PH9) STM32F7646BGT6.100(100_PH10) STM32F7646BGT6.101(101_PH11) STM32F7646BGT6.102(102_PH12) STM32F7646BGT6.111(111_PD11) STM32F7646BGT6.112(112_PD12) STM32F7646BGT6.113(113_PD13) STM32F7646BGT6.118(118_PJ6) STM32F7646BGT6.119(119_PJ7) STM32F7646BGT6.120(120_PJ8) STM32F7646BGT6.121(121_PJ9) STM32F7646BGT6.122(122_PJ10) STM32F7646BGT6.123(123_PJ11) STM32F7646BGT6.126(126_PK0) STM32F7646BGT6.127(127_PK1) STM32F7646BGT6.128(128_PK2) STM32F7646BGT6.130(130_PG3) STM32F7646BGT6.133(133_PG6) STM32F7646BGT6.134(134_PG7) STM32F7646BGT6.138(138_PC6) STM32F7646BGT6.139(139_PC7) STM32F7646BGT6.140(140_PC8) STM32F7646BGT6.141(141_PC9) STM32F7646BGT6.142(142_PA8) STM32F7646BGT6.145(145_PA11) STM32F7646BGT6.146(146_PA12) STM32F7646BGT6.151(151_PH13) STM32F7646BGT6.152(152_PH14) STM32F7646BGT6.153(153_PH15) STM32F7646BGT6.154(154_PI0) STM32F7646BGT6.155(155_PI1) STM32F7646BGT6.156(156_PI2) STM32F7646BGT6.157(157_PI13) STM32F7646BGT6.160(160_PA15) STM32F7646BGT6.161(161_PC10) STM32F7646BGT6.162(162_PC11) STM32F7646BGT6.163(163_PC12) STM32F7646BGT6.166(166_PD2) STM32F7646BGT6.167(167_PD3) STM32F7646BGT6.168(168_PD4) STM32F7646BGT6.169(169_PD5) STM32F7646BGT6.172(172_PD6) STM32F7646BGT6.173(173_PD7) STM32F7646BGT6.174(174_PJ12) STM32F7646BGT6.175(175_PJ13) STM32F7646BGT6.176(176_PJ14) STM32F7646BGT6.177(177_PJ15) STM32F7646BGT6.178(178_PG9) STM32F7646BGT6.179(179_PG10) STM32F7646BGT6.180(180_PG11) STM32F7646BGT6.181(181_PG12) STM32F7646BGT6.182(182_PG13) STM32F7646BGT6.183(183_PG14) STM32F7646BGT6.186(186_PK3) STM32F7646BGT6.187(187_PK4) STM32F7646BGT6.188(188_PK5) STM32F7646BGT6.189(189_PK6\) STM32F7646BGT6.190(190_PK7) STM32F7646BGT6.193(193_PB4) STM32F7646BGT6.194(194_PB5) STM32F7646BGT6.197(197_BOOT0) STM32F7646BGT6.199(199_PB9) STM32F7646BGT6.203(203_PDR_ON) STM32F7646BGT6.205(205_PI4) STM32F7646BGT6.206(206_PI5) STM32F7646BGT6.207(207_PI6) STM32F7646BGT6.208(208_PI7)

### Notes on the sheet
- ICU Microcontroller

## Library data of the parts
+3V3_H1-47 +5V L07-L09 L10 LED1 LED2 = led:LED: LED OSRAM: - CHIPLED LG R971, LG N971, LY N971, LG Q971, LY Q971, LO R971, LY R971 LH N974, LH R974 LS Q976, LO Q976, LY Q976 LO Q996 - Hyper CHIPLED LW Q18S LB Q993, LB Q99A, LB R99A - SideLED LS A670, LO A670, LY A670, LG A670, LP A670 LB A673, LV A673, LT A673, LW A673 LH A674 LY A675 LS A676, LA A676, LO A676, LY A676, LW A676 LS A679, LY A679, LG A679 - Hyper Micro SIDELED® LS Y876, LA Y876, LO Y876, LY Y876 LT Y87S - SmartLED LW L88C, LW L88S LB L89C, LB L89S, LG L890 LS L89K, LO L89K, LY L89K LS L896, LA L896, LO L896, LY L896 - TOPLED LS T670, LO T670, LY T670, LG T670, LP T670 LSG T670, LSP T670, LSY T670, LOP T670, LYG T670 LG T671, LOG T671, LSG T671 LB T673, LV T673, LT T673, LW T673 LH T674 LS T676, LA T676, LO T676, LY T676, LB T676, LH T676, LSB T676, LW T676 LB T67C, LV T67C, LT T67C, LS T67K, LO T67K, LY T67K, LW E67C LS E67B, LA E67B, LO E67B, LY E67B, LB E67C, LV E67C, LT E67C LW T67C LS T679, LY T679, LG T679 LS T770, LO T770, LY T770, LG T770, LP T770 LB T773, LV T773, LT T773, LW T773 LH T774 LS E675, LA E675, LY E675, LS T675 LS T776, LA T776, LO T776, LY T776, LB T776 LHGB T686 LT T68C, LB T68C - Hyper Mini TOPLED® LB M676 - Mini TOPLED Santana® LG M470 LS M47K, LO M47K, LY M47K Source: http://www.osram.convergy.de LUXEON: - LUMILED® LXK2-PW12-R00, LXK2-PW12-S00, LXK2-PW14-U00, LXK2-PW14-V00 LXK2-PM12-R00, LXK2-PM12-S00, LXK2-PM14-U00 LXK2-PE12-Q00, LXK2-PE12-R00, LXK2-PE12-S00, LXK2-PE14-T00, LXK2-PE14-U00 LXK2-PB12-K00, LXK2-PB12-L00, LXK2-PB12-M00, LXK2-PB14-N00, LXK2-PB14-P00, LXK2-PB14-Q00 LXK2-PR12-L00, LXK2-PR12-M00, LXK2-PR14-Q00, LXK2-PR14-R00 LXK2-PD12-Q00, LXK2-PD12-R00, LXK2-PD12-S00 LXK2-PH12-R00, LXK2-PH12-S00 LXK2-PL12-P00, LXK2-PL12-Q00, LXK2-PL12-R00 Source: www.luxeon.com KINGBRIGHT: KA-3528ASYC Source: www.kingbright.com
C1-C7 C9-C13 C18-C20 = rcl:C-EU: CAPACITOR, European symbol; SPICEPREFIX: C
CAMERA = con-lstb:MA08-1: PIN HEADER; OC_FARNELL: unknown; OC_NEWARK: unknown
D1 = SS34:SS34: TAIWAN SEMICONDUCTOR - SS34 - DIODE, SCHOTTKY, 3A, 40V Source: Datasheet <https://componentsearchengine.com/Datasheets/1/SS34.pdf>; ARROW_PART_NUMBER: SS34; ARROW_PRICE-STOCK: https://www.arrow.com/en/products/ss34/taiwan-semiconductor?region=nac; DESCRIPTION: TAIWAN SEMICONDUCTOR - SS34 - DIODE, SCHOTTKY, 3A, 40V; HEIGHT: 2.62mm; MANUFACTURER_NAME: Taiwan Semiconductor; MANUFACTURER_PART_NUMBER: SS34; MOUSER_PART_NUMBER: 821-SS34; MOUSER_PRICE-STOCK: https://www.mouser.co.uk/ProductDetail/Taiwan-Semiconductor/SS34?qs=JV7lzlMm3yIimVqgKV%2F1SA%3D%3D
ICU-PWR-SRC = pinhead:PINHD-2X4: PIN HEADER
ICU_PROG1 LOC_PWR_PROG PWR-UART_ICU = 0532610671:0532610671: 1.25mm Pitch PicoBlade™ Header, Surface Mount, Right Angle, 6 Circuits Check prices <https://pricing.snapeda.com/parts/0532610671/Molex/view-part?ref=eda>; AVAILABILITY: In Stock; DESCRIPTION: Picoblade Connector, 6 Circuit Single Row, Right Angle Surface Mount SMT PCB; MF: Molex; MP: 0532610671; PACKAGE: None; PRICE: None
ICU_XTAL1 = crystal:CRYSTAL: CRYSTAL; OC_FARNELL: unknown; OC_NEWARK: unknown
J2 = microUSB:10118192-0001LF: Single Port 5 Contact Horizontal Right Angle Shielded Micro B USB 2.0 Connector; AVAILABILITY: Unavailable; DESCRIPTION: USB - micro B USB 2.0 Receptacle Connector 5 Position Surface Mount, Right Angle; MF: Amphenol ICC; MP: 10118192-0001LF; PACKAGE: None; PRICE: None
L1 = rc-master-smd:L_: INDUCTOR
L2 = SamacSys_Parts:SRR1210-220M: Bourns SRR1210 Series Type 1210 Shielded Wire-wound SMD Inductor with a Ferrite Core, 22 uH +/-20% Wire-Wound 5.2A Idc Source: Datasheet <http://uk.rs-online.com/web/p/products/7633521>; ARROW_PART_NUMBER: SRR1210-220M; ARROW_PRICE-STOCK: https://www.arrow.com/en/products/srr1210-220m/bourns; DESCRIPTION: Bourns SRR1210 Series Type 1210 Shielded Wire-wound SMD Inductor with a Ferrite Core, 22 uH +/-20% Wire-Wound 5.2A Idc; HEIGHT: 10mm; MANUFACTURER_NAME: Bourns; MANUFACTURER_PART_NUMBER: SRR1210-220M; MOUSER_PART_NUMBER: 652-SRR1210-220M; MOUSER_PRICE-STOCK: https://www.mouser.co.uk/ProductDetail/Bourns/SRR1210-220M?qs=4vvWAaIu%2Fq78kzEYnPWgww%3D%3D
LOC_MEM LOCAL_MEM QSPI_MEM = SOIC127P600X175-16N_yas:SOIC127P600X175-16N
P1 = 5040501191:5040501191: 1.50mm Pitch, Pico-Lock PCB Header, Single Row, Right-Angle, Surface Mount, Gold (Au) Plating, Positive Lock, 11 Circuits, Tape and Reel Source: Datasheet <https://www.molex.com/pdm_docs/sd/5040500291_sd.pdf>; ARROW_PART_NUMBER: 5040501191; ARROW_PRICE-STOCK: https://www.arrow.com/en/products/5040501191/molex; DESCRIPTION: 1.50mm Pitch, Pico-Lock PCB Header, Single Row, Right-Angle, Surface Mount, Gold (Au) Plating, Positive Lock, 11 Circuits, Tape and Reel; HEIGHT: 2mm; MANUFACTURER_NAME: Molex; MANUFACTURER_PART_NUMBER: 5040501191
P2 = M80-6661442:M80-6661442: Datamate L-Tek DIL Male Horizontal SMT Connector, latched, selective gold + tin, 7+7 contacts Source: Datasheet <https://cdn.harwin.com/pdfs/M80-666.pdf>; DESCRIPTION: Datamate L-Tek DIL Male Horizontal SMT Connector, latched, selective gold + tin, 7+7 contacts; HEIGHT: 5.96mm; MANUFACTURER_NAME: Harwin; MANUFACTURER_PART_NUMBER: M80-6661442; MOUSER_PART_NUMBER: 855-M80-6661442; MOUSER_PRICE-STOCK: https://www.mouser.co.uk/ProductDetail/Harwin/M80-6661442?qs=dNol1vY4wtYr%2FkpdvpsPDw%3D%3D
P3 = 532610971:532610971: 1.25mm Pitch, PicoBlade PCB Header, Single Row, Right-Angle, Surface Mount, Tin (Sn) Plating, Friction Lock, 9 Circuits, Tape and Reel Source: Datasheet <https://www.molex.com/pdm_docs/sd/532610271_sd.pdf>; DESCRIPTION: 1.25mm Pitch, PicoBlade PCB Header, Single Row, Right-Angle, Surface Mount, Tin (Sn) Plating, Friction Lock, 9 Circuits, Tape and Reel; HEIGHT: 3.4mm; MANUFACTURER_NAME: Molex; MANUFACTURER_PART_NUMBER: 532610971
P4 = 53261-0471:53261-0471: 4 way SMT r/a header Molex PICOBLADE Series, Series Number 53261, 1.25mm Pitch 4 Way 1 Row Shrouded Right Angle PCB Header, Surface Mount Source: Datasheet <http://www.molex.com/webdocs/datasheets/pdf/en-us//0532610471_PCB_HEADERS.pdf>; DESCRIPTION: 4 way SMT r/a header Molex PICOBLADE Series, Series Number 53261, 1.25mm Pitch 4 Way 1 Row Shrouded Right Angle PCB Header, Surface Mount; HEIGHT: mm; MANUFACTURER_NAME: Molex; MANUFACTURER_PART_NUMBER: 53261-0471; MOUSER_PART_NUMBER: 538-53261-0471; MOUSER_PRICE-STOCK: https://www.mouser.co.uk/ProductDetail/Molex/53261-0471?qs=%252B72YyncTwW9e3et3PwnEMw%3D%3D
Q1 = ECS-.327-12.5-12QS-TR:ECS-.327-12.5-12QS-TR: SMD CRYSTAL 32.768 KHz; AVAILABILITY: Unavailable; DESCRIPTION: 32.768kHz ±20ppm Crystal 12.5pF 90 kOhms 2-SMD, No Lead; MF: ECS Inc.; MP: ECS-.327-12.5-12QS-TR; PACKAGE: SMD-2 ECS International; PRICE: None
R1 R2 R6 R34 R39-R41 = rcl:R-EU_: RESISTOR, European symbol; SPICEPREFIX: R
R3-R5 R7-R12 R15-R19 R22 R27 R33 = rcl:R-US_: RESISTOR, American symbol; SPICEPREFIX: R
R25 R76-R79 = BIRDS3_CAM_MSN:R0805(2012)
RESET = pinhead:PINHD-1X1: PIN HEADER
STM32F7646BGT6 = STM32F7:STM32F746BGT6
U1 = ATSAMD21G18A-AF:ATSAMD21G18A-AF: Cortex-M0+, 256KB FLASH, 32KB SRAM, USB, DMA, T&R - 48TQFP IND TEMP, GREEN, 1.6-3.6V, 48MHz; AVAILABILITY: Unavailable; DESCRIPTION: ARM® Cortex®-M0+ Automotive, AEC-Q100, SAM D21G Microcontroller IC 32-Bit 48MHz 256KB (256K x 8) FLASH 48-TQFP (7x7); MF: Microchip; MP: ATSAMD21G18A-AF; PACKAGE: TQFP-48 Microchip; PRICE: None
U3 = LM335D:LM335D: Precision temperature sensors; AVAILABILITY: Unavailable; DESCRIPTION: Temperature Sensor Analog, Local -40°C ~ 100°C 10mV/°C 8-SO; MF: STMicroelectronics; MP: LM335D; PACKAGE: SOIC-8 STMicroelectronics; PRICE: None
U4 = SN74CB3Q3257PW:SN74CB3Q3257PW: 4-BIT 1-OF-2 FET MULTIPLEXER/DEMULTIPLEXER; AVAILABILITY: Unavailable; DESCRIPTION: 4-Bit One-of-2 FET Multiplexer/Demultiplexer 2.5-V/3.3-V Low-Voltage, High-Bandwidth Bus Switch 16-TSSOP -40 to 85; MF: Texas Instruments; MP: SN74CB3Q3257PW; PACKAGE: TSSOP-16 Texas Instruments; PRICE: None
U5 = AS4C32M16SB-7TCN:AS4C32M16SB-7TCN: SDRAM Memory IC 512Mb (32M x 16) Parallel 166MHz 5ns 54-TSOP II Check prices <https://pricing.snapeda.com/parts/AS4C32M16SB-7TCN/Alliance%20Memory%2C/view-part?ref=eda>; AVAILABILITY: In Stock; DESCRIPTION: SDRAM Memory IC 512Mb (32M x 16) Parallel 143MHz 5.4ns 54-TSOP II; MF: Alliance Memory,; MP: AS4C32M16SB-7TCN; PACKAGE: TSOP-54 Alliance Memory; PRICE: None; PURCHASE-URL: https://pricing.snapeda.com/search/part/AS4C32M16SB-7TCN/?ref=eda
U6 = PCA9517AD:PCA9517AD: NXP PCA9517AD, 2-channel I/O Expander 400kHz, I2C, 8-Pin SOIC Source: Datasheet <https://datasheet.datasheetarchive.com/originals/distributors/SFDatasheet-4/sf-00081881.pdf>; DESCRIPTION: NXP PCA9517AD, 2-channel I/O Expander 400kHz, I2C, 8-Pin SOIC; HEIGHT: 1.75mm; MANUFACTURER_NAME: Nexperia; MANUFACTURER_PART_NUMBER: PCA9517AD; MOUSER_PART_NUMBER: 771-PCA9517AD; MOUSER_PRICE-STOCK: https://www.mouser.com/Search/Refine.aspx?Keyword=771-PCA9517AD
U$1 = Locana Board:PC-104
U$2 = MT3608:MT3608: MT3608 High Efficiency 1.2MHz 2A Step Up Converter BY: Rangana Tennakoon

## Net classes
0 default: width 0.203 mm
1 GND: width 0.254 mm